# Altium schematic sheet connector_temp_level.SchDoc
size A
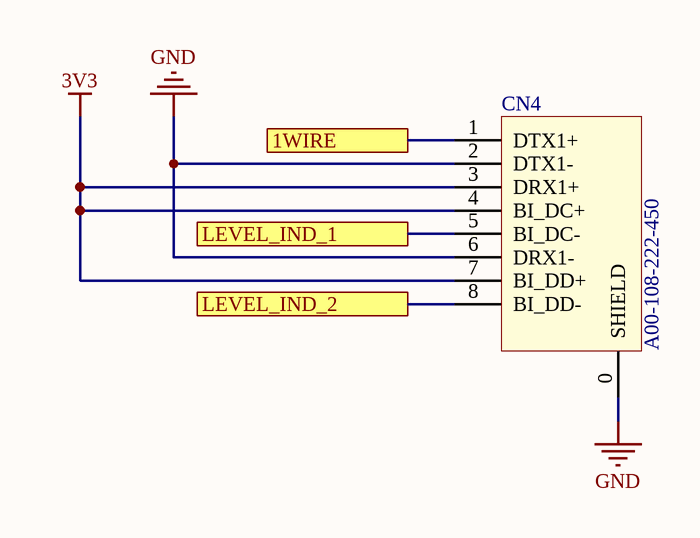
[diagram p0: connector_temp_level.SchDoc]

## Parts
CN4  MFG P/N: A00-108-222-450  [RJ45 TOP ENTRY EDAC A00-108-222-450]  (hidden comment: CONN_RJ45_TOP_A00-108-222-450)

## Ports
1WIRE, LEVEL_IND_1, LEVEL_IND_2

## Nets
3V3: CN4.3(DRX1+) CN4.4(BI_DC+) CN4.7(BI_DD+)
GND: CN4.0(SHIELD) CN4.2(DTX1-) CN4.6(DRX1-)
1WIRE: CN4.1(DTX1+) ; port 1WIRE
LEVEL_IND_1: CN4.5(BI_DC-) ; port LEVEL_IND_1
LEVEL_IND_2: CN4.8(BI_DD-) ; port LEVEL_IND_2

## Library data of the parts
CN4 = 492: CONN, RJ-45, 1-PORT, 8-POS, VERT, 0.76um GOLD, TH; ID: 492; MFG: EDAC Inc; COMMON: 210-00203-00; XPN: XS-10003929; Status: In Development; RoHS Compliant: Yes; LOON: 210-00203-00; Gecko: 210-00203-00